# Altium schematic sheet MCU_RP2350.SchDoc: STM32F446 CNC
size B; Author: AM; CompanyName: Expatria Technologies; DrawnBy: A.Marles; Engineer: AM; Organization: Expatria Technologies; DocumentNumber: 3; SheetNumber: 3; SheetTotal: 14
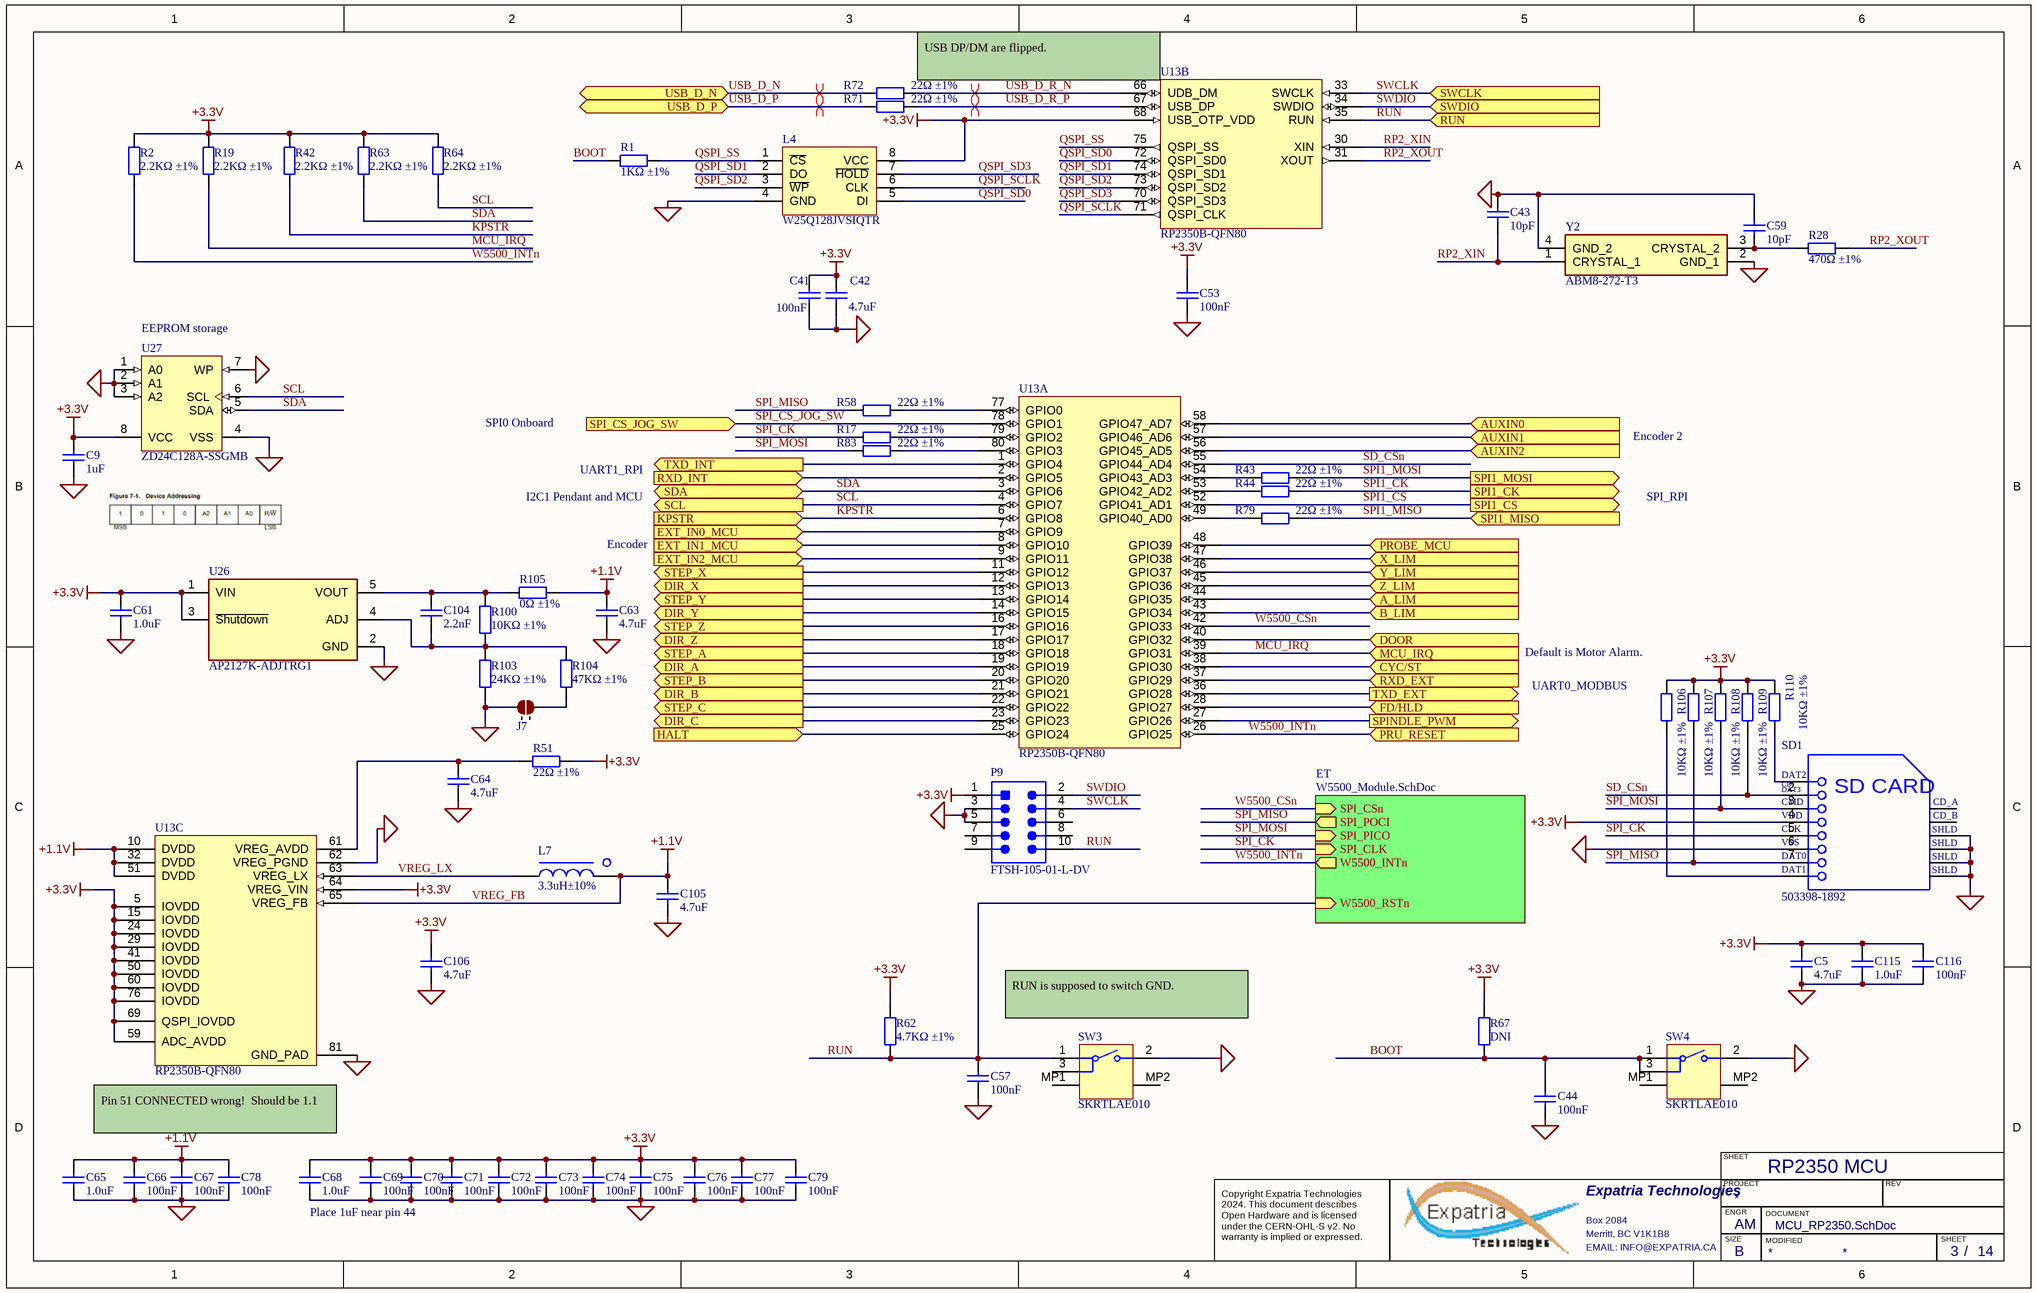
[diagram p0: MCU_RP2350.SchDoc]

## Parts
C5  4.7uF  [0603_C]
C9  1uF  [0603_C]
C41  100nF  [0402_C]
C42  4.7uF  [0402_C]
C43  10pF  [0402_C]
C44  100nF  [0402_C]
C53  100nF  [0402_C]
C57  100nF  [0402_C]
C59  10pF  [0402_C]
C61  1.0uF  [0402_C]
C63  4.7uF  [0402_C]
C64  4.7uF  [0402_C]
C65  1.0uF  [0402_C]
C66  100nF  [0402_C]
C67  100nF  [0402_C]
C68  1.0uF  [0402_C]
C69  100nF  [0402_C]
C70  100nF  [0402_C]
C71  100nF  [0402_C]
C72  100nF  [0402_C]
C73  100nF  [0402_C]
C74  100nF  [0402_C]
C75  100nF  [0402_C]
C76  100nF  [0402_C]
C77  100nF  [0402_C]
C78  100nF  [0402_C]
C79  100nF  [0402_C]
C104  2.2nF  [0402_C]
C105  4.7uF  [0402_C - wide]
C106  4.7uF  [0402_C - wide]
C115  1.0uF  [0402_C]
C116  100nF  [0402_C]
J7  2 way net solder junction - Normally Open  [2waySolder_NO]  (value not drawn)  (net tie, no BOM)
L4  W25Q128JVSIQTR  [SOIC-8_208mil]
L7  3.3uH±10%  [0806_L_POL]
P9  FTSH-105-01-L-DV  [SMTC-FTSH-105-01-L-DV_V]
R1  1KΩ ±1%  [0402_R]
R2  2.2KΩ ±1%  [0402_R]
R17  22Ω ±1%  [0402_R]
R19  2.2KΩ ±1%  [0402_R]
R28  470Ω ±1%  [0402_R]
R42  2.2KΩ ±1%  [0402_R]
R43  22Ω ±1%  [0402_R]
R44  22Ω ±1%  [0402_R]
R51  22Ω ±1%  [0402_R]
R58  22Ω ±1%  [0402_R]
R62  4.7KΩ ±1%  [0402_R]
R63  2.2KΩ ±1%  [0402_R]
R64  2.2KΩ ±1%  [0402_R]
R67  DNI  [0603_R]  (no BOM)
R71  22Ω ±1%  [0402_R]
R72  22Ω ±1%  [0402_R]
R79  22Ω ±1%  [0402_R]
R83  22Ω ±1%  [0402_R]
R100  10KΩ ±1%  [0402_R]
R103  24KΩ ±1%  [0402_R]
R104  47KΩ ±1%  [0402_R]
R105  0Ω ±1%  [0402_R]
R106  10KΩ ±1%  [0402_R]
R107  10KΩ ±1%  [0402_R]
R108  10KΩ ±1%  [0402_R]
R109  10KΩ ±1%  [0402_R]
R110  10KΩ ±1%  [0402_R]
SD1  503398-1892  [MOLX-503398-1892_V]
SW3  SKRTLAE010  [ALPS-SKRTLAE010_V]
SW4  SKRTLAE010  [ALPS-SKRTLAE010_V]
U13  RP2350B-QFN80  [RP2350B-QFN80]  (parts A,B,C of 3)
U26  AP2127K-ADJTRG1  [FP-SOT25-MFG]
U27  ZD24C128A-SSGMB  [SOIC-SN8_L]
Y2  ABM8-272-T3  [YSX321SL]

## Sub-sheets
ET = W5500_Module.SchDoc: SPI_CSn (in), SPI_POCI (out), W5500_RSTn (in), SPI_CLK (in), SPI_PICO (in), W5500_INTn (out)

## Ports
A_LIM (in), AUXIN0 (in), AUXIN1 (in), AUXIN2 (in), B_LIM (in), CYC/ST (in), DIR_A (out), DIR_B (out), DIR_C (out), DIR_X (out), DIR_Y (out), DIR_Z (out), DOOR (in), EXT_IN0_MCU (in), EXT_IN1_MCU (in), EXT_IN2_MCU (in), FD/HLD (in), HALT (in), KPSTR (in), MCU_IRQ (in), PROBE_MCU (in), PRU_RESET (in), RUN (in), RXD_EXT (in), RXD_INT (in), SCL (out), SDA (bidir), SPI1_CK (out), SPI1_CS (out), SPI1_MISO (in), SPI1_MOSI (out), SPI_CS_JOG_SW (in), SPINDLE_PWM (out), STEP_A (out), STEP_B (out), STEP_C (out), STEP_X (out), STEP_Y (out), STEP_Z (out), SWCLK (in), SWDIO (in), TXD_EXT (out), TXD_INT (out), USB_D_N (bidir), USB_D_P (bidir), X_LIM (in), Y_LIM (in), Z_LIM (in)

## Nets
+3.3V: C5.2 C9.2 C41.2 C42.2 C53.2 C61.2 C68.2 C69.2 C70.2 C71.2 C72.2 C73.2 C74.2 C75.2 C76.2 C77.2 C79.2 C106.2 C115.2 C116.2 L4.8(VCC) P9.1 R2.2 R19.2 R42.2 R51.2 R62.2 R63.2 R64.2 R67.1 R106.2 R107.2 R108.2 R109.2 R110.2 SD1.4(VDD) U13.5(IOVDD) U13.15(IOVDD) U13.24(IOVDD) U13.29(IOVDD) U13.41(IOVDD) U13.50(IOVDD) U13.59(ADC_AVDD) U13.60(IOVDD) U13.64(VREG_VIN) U13.68(USB_OTP_VDD) U13.69(QSPI_IOVDD) U13.76(IOVDD) U26.1(VIN) U26.3(~{Shutdown}) U27.8(VCC)
MCU_GND: C5.1 C9.1 C41.1 C42.1 C43.2 C44.1 C53.1 C57.1 C59.2 C61.1 C63.1 C64.1 C65.1 C66.1 C67.1 C68.1 C69.1 C70.1 C71.1 C72.1 C73.1 C74.1 C75.1 C76.1 C77.1 C78.1 C79.1 C105.1 C106.1 C115.1 C116.1 J7.1 L4.4(GND) P9.3 P9.5 R103.1 SD1.6(VSS) SD1.11(SHLD) SD1.12(SHLD) SD1.13(SHLD) SD1.14(SHLD) SW3.2 SW4.2 U13.62(VREG_PGND) U13.81(GND_PAD) U26.2(GND) U27.1(A0) U27.2(A1) U27.3(A2) U27.4(VSS) U27.7(WP) Y2.2(GND_1) Y2.4(GND_2)
VREG_FB: C63.2 C65.2 C66.2 C67.2 C78.2 C105.2 L7.2 R105.2 U13.10(DVDD) U13.32(DVDD) U13.51(DVDD) U13.65(VREG_FB)  [also labelled +1.1V]
A_LIM: U13.44(GPIO35) ; port A_LIM
AUXIN0: U13.58(GPIO47_AD7) ; port AUXIN0
AUXIN1: U13.57(GPIO46_AD6) ; port AUXIN1
AUXIN2: U13.56(GPIO45_AD5) ; port AUXIN2
B_LIM: U13.43(GPIO34) ; port B_LIM
BOOT: C44.2 R1.1 R67.2 SW4.1 SW4.3
CYC/ST: U13.38(GPIO30) ; port CYC/ST
DIR_A: U13.19(GPIO19) ; port DIR_A
DIR_B: U13.21(GPIO21) ; port DIR_B
DIR_C: U13.23(GPIO23) ; port DIR_C
DIR_X: U13.12(GPIO13) ; port DIR_X
DIR_Y: U13.14(GPIO15) ; port DIR_Y
DIR_Z: U13.17(GPIO17) ; port DIR_Z
DOOR: U13.40(GPIO32) ; port DOOR
EXT_IN0_MCU: U13.7(GPIO9) ; port EXT_IN0_MCU
EXT_IN1_MCU: U13.8(GPIO10) ; port EXT_IN1_MCU
EXT_IN2_MCU: U13.9(GPIO11) ; port EXT_IN2_MCU
FD/HLD: U13.28(GPIO27) ; port FD/HLD
HALT: U13.25(GPIO24) ; port HALT
KPSTR: R42.1 U13.6(GPIO8) ; port KPSTR
MCU_IRQ: R19.1 U13.39(GPIO31) ; port MCU_IRQ
PROBE_MCU: U13.48(GPIO39) ; port PROBE_MCU
QSPI_SCLK: L4.6(CLK) U13.71(QSPI_CLK)
QSPI_SD0: L4.5(DI) U13.72(QSPI_SD0)
QSPI_SD1: L4.2(DO) U13.74(QSPI_SD1)
QSPI_SD2: L4.3(~{WP}) U13.73(QSPI_SD2)
QSPI_SD3: L4.7(~{HOLD}) U13.70(QSPI_SD3)
QSPI_SS: L4.1(~{CS}) R1.2 U13.75(QSPI_SS)
RP2_XIN: C43.1 U13.30(XIN) Y2.1(CRYSTAL_1)
RP2_XOUT: R28.2 U13.31(XOUT)
RUN: C57.2 P9.10 R62.1 SW3.1 U13.35(RUN) ; port RUN, sheet ET/W5500_RSTn
RXD_EXT: U13.37(GPIO29) ; port RXD_EXT
RXD_INT: U13.2(GPIO5) ; port RXD_INT
SCL: R64.1 U13.4(GPIO7) U27.6(SCL) ; port SCL
SD_CSn: R109.1 SD1.2(CD/DAT3) U13.55(GPIO44_AD4)
SDA: R63.1 U13.3(GPIO6) U27.5(SDA) ; port SDA
SPI1_CK: R44.1 ; port SPI1_CK
SPI1_CS: U13.52(GPIO41_AD1) ; port SPI1_CS
SPI1_MISO: R79.1 ; port SPI1_MISO
SPI1_MOSI: R43.1 ; port SPI1_MOSI
SPI_CK: R17.2 SD1.5(CLK) ; sheet ET/SPI_CLK
SPI_CS_JOG_SW: U13.78(GPIO1) ; port SPI_CS_JOG_SW
SPI_MISO: R58.2 R107.1 SD1.7(DAT0) ; sheet ET/SPI_POCI
SPI_MOSI: R83.2 R108.1 SD1.3(CMD) ; sheet ET/SPI_PICO
SPINDLE_PWM: U13.27(GPIO26) ; port SPINDLE_PWM
STEP_A: U13.18(GPIO18) ; port STEP_A
STEP_B: U13.20(GPIO20) ; port STEP_B
STEP_C: U13.22(GPIO22) ; port STEP_C
STEP_X: U13.11(GPIO12) ; port STEP_X
STEP_Y: U13.13(GPIO14) ; port STEP_Y
STEP_Z: U13.16(GPIO16) ; port STEP_Z
SWCLK: P9.4 U13.33(SWCLK) ; port SWCLK
SWDIO: P9.2 U13.34(SWDIO) ; port SWDIO
TXD_EXT: U13.36(GPIO28) ; port TXD_EXT
TXD_INT: U13.1(GPIO4) ; port TXD_INT
USB_D_N: R72.2 ; port USB_D_N
USB_D_P: R71.2 ; port USB_D_P
USB_D_R_N: R72.1 U13.66(UDB_DM)
USB_D_R_P: R71.1 U13.67(USB_DP)
VREG_LX: L7.1 U13.63(VREG_LX)
W5500_CSn: U13.42(GPIO33) ; sheet ET/SPI_CSn
W5500_INTn: R2.1 U13.26(GPIO25) ; port PRU_RESET, sheet ET/W5500_INTn
X_LIM: U13.47(GPIO38) ; port X_LIM
Y_LIM: U13.46(GPIO37) ; port Y_LIM
Z_LIM: U13.45(GPIO36) ; port Z_LIM
NetC59_1: C59.1 R28.1 Y2.3(CRYSTAL_2)
NetC64_2: C64.2 R51.1 U13.61(VREG_AVDD)
NetC104_1: C104.1 R100.1 R103.2 R104.2 U26.4(ADJ)
NetC104_2: C104.2 R100.2 R105.1 U26.5(VOUT)
NetJ7_2: J7.2 R104.1
NetR17_1: R17.1 U13.79(GPIO2)
NetR43_2: R43.2 U13.54(GPIO43_AD3)
NetR44_2: R44.2 U13.53(GPIO42_AD2)
NetR58_1: R58.1 U13.77(GPIO0)
NetR79_2: R79.2 U13.49(GPIO40_AD0)
NetR83_1: R83.1 U13.80(GPIO3)
NetR106_1: R106.1 SD1.8(DAT1)
NetR110_1: R110.1 SD1.1(DAT2)

Not connected (* = marked no-connect by the designer): P9 6 7 8 9; SD1 9(CD_A) 10(CD_B); SW3 3 MP1 MP2; SW4 MP1 MP2

## Layout directives
differential pair: USB_D_N, USB_D_P, USB_D_R_N, USB_D_R_P

## Notes on the sheet
- USB DP/DM are flipped.
- (near U27) EEPROM storage
- SPI0 Onboard
- I2C1 Pendant and MCU
- UART1_RPI
- Encoder 2
- SPI_RPI
- Encoder
- Default is Motor Alarm.
- UART0_MODBUS
- RUN is supposed to switch GND.
- Pin 51 CONNECTED wrong!  Should be 1.1
- RP2350 MCU
- Place 1uF near pin 44
- SHEET
- Expatria Technologies
- Box 2084
- Merritt, BC V1K1B8
- PROJECT
- SIZE
- ENGR
- MODIFIED
- DOCUMENT
- REV
- Copyright Expatria Technologies 2024. This document describes Open Hardware and is licensed under the CERN-OHL-S v2. No warranty is implied or expressed.
- EMAIL: INFO@EXPATRIA.CA
- B
- /
- (in symbol CMP-2000-05621-1) CD/; DAT3; SD CARD

## Library data of the parts
C5 = 0603 4.7uF (475) 10% 16V: 16V 4.7uF X5R ±10% 0603 Multilayer Ceramic Capacitors MLCC - SMD/SMT ROHS; Manufacturer: Samsung Electro-Mechanics; Manufacturer Part Number: CL10A475KO8NNNC; ComponentLink1Description: Supplier link; ComponentLink1URL: http://www.szlcsc.com/product/details_20375.html; Package: 0603; Supplier: LC; SuppliersPartNumber: C19666; Capacitance: 4.7uF; Tolerance: 10%; Voltage: 16V
C9 = 0603 1uF (105) 10% 50V: Chip capacitors; Manufacturer: Samsung Electro-Mechanics; PartNumber: CL10A105KB8NNNC; Tolerance: 10%; Voltage: 50V; Package: 0603; Supplier: LC; SuppliersPartNumber: C15849; Capacitance: 1uF; ComponentLink1Description: Supplier link; ComponentLink1URL: http://www.szlcsc.com/product/details_16531.html
C41 C44 C53 C57 C66 C67 C69-C79 = 0402 100nF (104) 10% 16V: Chip capacitors; Manufacturer: Samsung Electro-Mechanics; PartNumber: CL05B104KO5NNNC; Tolerance: 10%; Voltage: 16V; ComponentLink1Description: Supplier link; ComponentLink1URL: http://www.szlcsc.com/product/details_1877.html; Package: 0402; Supplier: LC; SuppliersPartNumber: C1525; Capacitance: 100nF
C42 C63 C64 C105 C106 = 0402 4.7uF (475) 20% 10V: Chip capacitor; Manufacturer: Samsung Electro-Mechanics; PartNumber: CL05A475MP5NRNC; Tolerance: 20%; Voltage: 10V; ComponentLink1Description: Supplier link; ComponentLink1URL: http://www.szlcsc.com/product/details_24469.html; Package: 0402; Supplier: LC; SuppliersPartNumber: C23733; Capacitance: 4.7uF
C43 C59 = 0402 10pF (100) 5% 50V: Chip capacitors; Manufacturer: Samsung Electro-Mechanics; PartNumber: CL05C100JB5NNNC; Tolerance: 5%; Voltage: 50V; ComponentLink1Description: Supplier link; ComponentLink1URL: http://www.szlcsc.com/product/details_33914.html; Package: 0402; Supplier: LC; SuppliersPartNumber: C32949; Capacitance: 10pF
C61 C65 C68 = 0402 1.0uF (105) 10% 25V: Chip capacitor; Manufacturer: Samsung Electro-Mechanics; PartNumber: CL05A105KA5NQNC; Capacitance: 1uF; Tolerance: 10%; Voltage: 25V; ComponentLink1Description: Supplier link; ComponentLink1URL: http://www.szlcsc.com/product/details_53938.html; Package: 0402; Supplier: LC; SuppliersPartNumber: C52923
C104 = 0402 2.2nF (222) 10% 50V: Chip capacitor; Manufacturer: Guangdong Fenghua Advanced Tech; PartNumber: 0402B222K500NT; Tolerance: 10%; Voltage: 50V; ComponentLink1Description: Supplier link; ComponentLink1URL: http://www.szlcsc.com/product/details_1883.html; Package: 0402; Supplier: LC; SuppliersPartNumber: C1531; Capacitance: 2.2nF
C115 = 0402 1.0uF (105) 10% 25V: Chip capacitor; Manufacturer: Samsung Electro-Mechanics; Manufacturer Part Number: CL05A105KA5NQNC; Capacitance: 1uF; Tolerance: 10%; Voltage: 25V; ComponentLink1Description: Supplier link; ComponentLink1URL: http://www.szlcsc.com/product/details_53938.html; Package: 0402; Supplier: LC; SuppliersPartNumber: C52923
C116 = 0402 100nF (104) 10% 16V: 16V 100nF X7R ±10% 0402 Multilayer Ceramic Capacitors MLCC - SMD/SMT ROHS; Manufacturer: Samsung Electro-Mechanics; Manufacturer Part Number: CL05B104KO5NNNC; ComponentLink1Description: Supplier link; ComponentLink1URL: http://www.szlcsc.com/product/details_1877.html; Package: 0402; Supplier: LC; SuppliersPartNumber: C1525; Capacitance: 100nF; Tolerance: 10%; Voltage: 16V
J7 = 2waySolderNO: ComponentLink1URL: http://www.edatools.cz/addons; ComponentLink1Description: Source
L4 = W25Q128JVSIQTR_[C97521]: Flash ROM; SuppliersPartNumber: C97521; ComponentLink1Description: 供应商链接; ComponentLink1URL: https://item.szlcsc.com/98729.html; Package: SOIC-8; Supplier: LC
L7 = 0806 3.3uH Polarized RP2350: 贴片电感; ComponentLink1Description: 供应商链接; ComponentLink1URL: http://www.szlcsc.com/product/details_52738.html; Package: 0805; Supplier: LC; SuppliersPartNumber: C42411119
P9 = CMP-2000-05354-1: Male Header, Pitch 1.27 mm, 2 x 5 Position, Height 5.96 mm, -55 to 125 degC, RoHS, Bulk; Manufacturer: Samtec; Connector Type: Header,Unshrouded; Pitch: 0.050"(1.27mm); Mating Products: FLE-105-01-G-DV-TR-ND-CONNSKT1.27MM10POSDUALSMDCLP-105-02-G-D-P-TR-ND-CONNRCPT10POSDUAL.05"SMDSFMC-105-L2-S-D-TR-ND-CONN.05"SURFACE10POSSMTSFMH-105-02-L-D-TR-ND-CONNRECEPT10POS.50"SMTFLE-105-01-G-DV-A-ND-CONNSKT1.27MM10POSDUALSMDCLP-105-02-G-D-BE-ND-CONNRCPT10POSDUAL.05"SMDFLE-105-01-G-DV-A-P-ND-CONNSKT1.27MM10POSDUALSMDSAM1153-05-ND-CONNRCPT10POSDUAL.05"SMDSAM1155-05-ND-CONNRCPT10POSDUAL.05"SMDSAM1154-05-ND-CONNRCPT10POSDUAL.05"SMDSFMH-105-02-L-D-LC-ND-CONNRECEPT10POS.50"SMTSAM1226-05-ND-CONNRCPT.05"10POSDUALSMD; Catalog Drawings: FTSHSeriesFTSHSeriesSMTSide; Other Names: SAM1161-05; EDA / CAD Models: DownloadfromAcceleratedDesigns; Number of Positions Loaded: All; Number of Positions: 10; Featured Product: Board-To-BoardInterconnectSystems; Online Catalog: FTSHSeries; Product Training Modules: Board-to-BoardConnectors; Category: Connectors,Interconnects; Number of Rows: 2; Contact Finish: Gold; Termination: Solder; Mounting Type: SurfaceMount; Series: FTSH; Contact Mating Length: 0.120"(3.05mm); Row Spacing: 0.050"(1.27mm); Datasheet URL: https://datasheet.ciiva.com/30493/0900766b80adfe36-30493006.pdf; Contact Finish Thickness: 10µin(0.25µm); Features: -; Standard Package: 1; Packaging: Bulk; Datasheet Version: Feb-08; Manufacturer URL: http://www.samtec.com/; Fastening Type: -; Family: RectangularConnectors-Headers,MalePins; Contact Type: MalePin; Color: Black
R1 = 0402 1K (1001) 1%: Chip resistor; Manufacturer: Uniroyal Elec; PartNumber: 0402WGF1001TCE; Power: 1/16W; ComponentLink1Description: Supplier link; ComponentLink1URL: http://www.szlcsc.com/product/details_12256.html; Package: 0402; Supplier: LC; SuppliersPartNumber: C11702; Resistance: 1KΩ; Tolerance: 1%
R2 R19 R42 R63 R64 = 0402 2.2K (2201) 1%: Chip resistor; Manufacturer: Uniroyal Elec; PartNumber: 0402WGF2201TCE; Power: 1/16W; ComponentLink1Description: Supplier link; ComponentLink1URL: http://www.szlcsc.com/product/details_26622.html; Package: 0402; Supplier: LC; SuppliersPartNumber: C25879; Resistance: 2.2KΩ; Tolerance: 1%
R17 R43 R44 R51 R58 R71 R72 R79 R83 = 0402 22R (22R0) 1%: Chip resistor; Manufacturer: Uniroyal Elec; PartNumber: 0402WGF220JTCE; Power: 1/16W; ComponentLink1Description: Supplier link; ComponentLink1URL: http://www.szlcsc.com/product/details_25835.html; Package: 0402; Supplier: LC; SuppliersPartNumber: C25092; Resistance: 22Ω; Tolerance: 1%
R28 = 0402 470R (4700) 1%: Chip resistor; Manufacturer: Uniroyal Elec; PartNumber: 0402WGF4700TCE; Power: 1/16W; ComponentLink1Description: Supplier link; ComponentLink1URL: http://www.szlcsc.com/product/details_25860.html; Package: 0402; Supplier: LC; SuppliersPartNumber: C25117; Resistance: 470Ω; Tolerance: 1%
R62 = 0402 4.7K (4701) 1%: Chip resistor; Manufacturer: Uniroyal Elec; PartNumber: 0402WGF4701TCE; Power: 1/16W; ComponentLink1Description: Supplier link; ComponentLink1URL: http://www.szlcsc.com/product/details_26643.html; Package: 0402; Supplier: LC; SuppliersPartNumber: C25900; Resistance: 4.7KΩ; Tolerance: 1%
R67 = 0603 10K (1002) 1%: Chip resistor; Manufacturer: Uniroyal Elec; PartNumber: 0603WAF1002T5E; Power: 1/10W; Resistance: 10KΩ; Tolerance: 1%; ComponentLink1Description: Supplier link; ComponentLink1URL: http://www.szlcsc.com/product/details_26547.html; Package: 0603; Supplier: LC; SuppliersPartNumber: C25804
R100 R106-R110 = 0402 10K (1002) 1%: Chip resistor; Manufacturer: Uniroyal Elec; PartNumber: 0402WGF1002TCE; Power: 1/16W; ComponentLink1Description: Supplier link; ComponentLink1URL: http://www.szlcsc.com/product/details_26487.html; Package: 0402; Supplier: LC; SuppliersPartNumber: C25744; Resistance: 10KΩ; Tolerance: 1%
R103 = 0402 24K (2402) 1%: Chip resistor; Manufacturer: Uniroyal Elec; PartNumber: 0402WGF2402TCE; Power: 1/16W; ComponentLink1Description: Supplier link; ComponentLink1URL: http://www.szlcsc.com/product/details_26512.html; Package: 0402; Supplier: LC; SuppliersPartNumber: C25769; Resistance: 24KΩ; Tolerance: 1%
R104 = 0402 47K (4702) 1%: Chip resistor; Manufacturer: Uniroyal Elec; PartNumber: 0402WGF4702TCE; Power: 1/16W; ComponentLink1Description: Supplier link; ComponentLink1URL: http://www.szlcsc.com/product/details_26535.html; Package: 0402; Supplier: LC; SuppliersPartNumber: C25792; Resistance: 47KΩ; Tolerance: 1%
R105 = 0402 0R (0R0) 1%: Chip resistor; Manufacturer: Uniroyal Elec; PartNumber: 0402WGF0000TCE; Power: 1/16W; ComponentLink1Description: Supplier link; ComponentLink1URL: http://www.szlcsc.com/product/details_17853.html; Package: 0402; Supplier: LC; SuppliersPartNumber: C17168; Resistance: 0Ω; Tolerance: 1%
SD1 = CMP-2000-05621-1: Micro SD Connector, Pitch 1.1 mm, 8 Position, Height 1.4 mm, -25 to 85 degC, RoHS, Tape and Reel; Manufacturer: Molex; Voltage Rating: 10VAC/DC; Manufacturer URL: http://www.molex.com/; Package Reference: 503398-1892; Packaging: Reel; RoHS: Details; Brand: Molex; Series: 503398; SuppliersPartNumber: C428492
SW3 SW4 = CMP-2000-07073-2: Side Push Type, 250 V, -40 to 90 degC, 3-Pin SMD, RoHS, Tape and Reel; Manufacturer: ALPS; Operating Force: 1.6N; Folder: Unified Components\Components\New Releases\New\; Maximum Current Rating: 0.05@12VDCA; RevisionId: 1; Pole Throw Configuration: SPST; Switch Configuration: N.O.; AccessRights: 2147483647; Maximum DC Voltage Rating: 12V; ContentType: Unified Component; Rad Hard: No; Mounting: SurfaceMount; Datasheet URL: http://www.alps.com/prod/info/E/PDF/Tact/SurfaceMount/SKRT/SKRT.PDF; Manufacturer URL: http://www.alps.com/e/; ReleaseDate: 22/09/2017 06:13:25 AM; ItemHRID: CMP-2000-07073; ContentTypeGUID: CB3C11C4-E317-11DF-B822-12313F0024A2; LifeCycle: Released; ItemGUID: EAC55BEC-37DC-4BDB-8BA7-D75E6D5C3D75; Packaging: Tape&Reel; Package Reference: SKRTLAE010; FolderGUID: B7F4506A-9127-42E7-A087-46FE7B18D116; Datasheet Version: 06/2015; Mounting Technology: SurfaceMount; LifeCycleStateGUID: 61E382EE-6656-4F12-9E24-BE9327104A25; Package Description: 3-Pin Surface Mount Device, Body 4.5 x 3.55 mm, Pitch 1.225 mm; SuppliersPartNumber: C110293; Manufacturer 1: ALPS
U13 = RP2350B-QFN80: Second MCU from RPI
U26 = CMP-12756-000019-1: IC REG LIN POS ADJ 300MA SOT23-5; Manufacturer: Diodes Inc.; Output Type: AdjustableProgrammable; Number Of Outputs: 1; Nominal Supply Current: 60uA; Min Supply Voltage: 2.5V; Dropout Voltage: 1400mV; Output Voltage: 0.8-5.5V; Standoff Height: 0.013mm; Output Current: 400mA; Max Supply Voltage: 6V; Accuracy Percentage: 2%; Max Junction Temp: +150°C; Temperature Range Low: -40°C; Height: 1.4mm; Automotive: No; Device Class L1: Integrated Circuits (ICs); Temperature: -40°C to +85°C; Manufacturer Part Number: AP2127K-ADJTRG1; RoHS: TRUE; Ambient Temperature Range Low: -40°C; Ipc Land Pattern Name: SOT95P280X140-5; Octopart: https://octopart.com/ap2127k-adjtrg1-diodes+inc.-30954599; Temperature Range High: +85°C; Ambient Temperature Range High: +85°C; Device Class L3: Voltage Regulators - Linear; ComponentLink2Description: Datasheet; Digikey Description: IC REG LIN POS ADJ 300MA SOT23-5; Footprint Url: https://www.diodes.com/assets/Package-Files/SOT25.pdf; Lead Free: Yes; ComponentLink2URL: https://www.diodes.com/assets/Datasheets/AP2127.pdf; Device Class L2: Power Management ICs; Package: SOT25; Mouser Description: LDO Voltage Regulators 300mA CMOS LDO 2.5V to 6V; Category: IC; SuppliersPartNumber: C96343
U27 = CMP-0159-00216-1: IC EEPROM 128KBIT I2C 8SOIC; SuppliersPartNumber: C918271
Y2 = YSX321SL: Crystal or Oscillator 12MHz RP2350; Manufacturer_Name: Abracom; Height: 0.8mm; Manufacturer_Part_Number: ABM8-272-T3; SuppliersPartNumber: C20625731